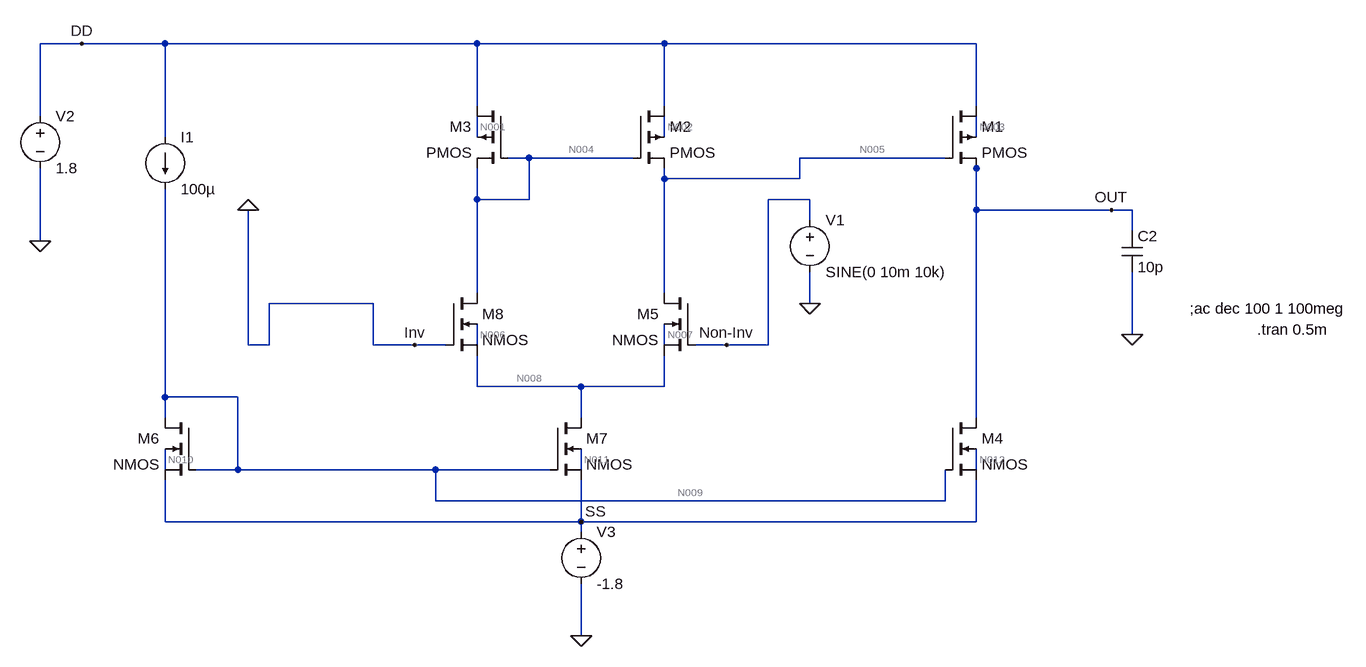
[diagram p0: schematic opamp_comparator.asc]
opamp_comparator.asc, the LTspice schematic file:
Version 4
SHEET 1 1048 884
WIRE -912 -144 -976 -144
WIRE -784 -144 -912 -144
WIRE -304 -144 -784 -144
WIRE -16 -144 -304 -144
WIRE 464 -144 -16 -144
WIRE -304 -48 -304 -144
WIRE -16 -48 -16 -144
WIRE 464 -48 464 -144
WIRE -976 -32 -976 -144
WIRE -784 0 -784 -144
WIRE -304 0 -304 -32
WIRE -16 0 -16 -32
WIRE 464 0 464 -32
WIRE -224 32 -256 32
WIRE -64 32 -224 32
WIRE 416 32 192 32
WIRE 464 48 464 32
WIRE -16 64 -16 48
WIRE 192 64 192 32
WIRE 192 64 -16 64
WIRE -304 96 -304 48
WIRE -224 96 -224 32
WIRE -224 96 -304 96
WIRE 208 96 144 96
WIRE 464 112 464 48
WIRE 672 112 464 112
WIRE 704 112 672 112
WIRE 208 128 208 96
WIRE 704 144 704 112
WIRE -976 160 -976 48
WIRE -304 240 -304 96
WIRE -16 240 -16 64
WIRE -464 256 -624 256
WIRE 208 256 208 208
WIRE 704 304 704 208
WIRE -656 320 -656 112
WIRE -624 320 -624 256
WIRE -624 320 -656 320
WIRE -464 320 -464 256
WIRE -400 320 -464 320
WIRE -352 320 -400 320
WIRE -304 320 -304 288
WIRE -16 320 -16 288
WIRE 80 320 32 320
WIRE 144 320 144 96
WIRE 144 320 80 320
WIRE -304 384 -304 336
WIRE -144 384 -304 384
WIRE -16 384 -16 336
WIRE -16 384 -144 384
WIRE -784 400 -784 80
WIRE -672 400 -784 400
WIRE -784 432 -784 400
WIRE -144 432 -144 384
WIRE 464 432 464 112
WIRE -784 512 -784 480
WIRE -672 512 -672 400
WIRE -672 512 -736 512
WIRE -368 512 -672 512
WIRE -192 512 -368 512
WIRE -144 512 -144 480
WIRE 464 512 464 480
WIRE -368 560 -368 512
WIRE 416 560 416 512
WIRE 416 560 -368 560
WIRE -784 592 -784 528
WIRE -144 592 -144 528
WIRE -144 592 -784 592
WIRE 464 592 464 528
WIRE 464 592 -144 592
WIRE -144 608 -144 592
WIRE -144 768 -144 688
FLAG 704 304 0
FLAG -656 112 0
FLAG -976 160 0
FLAG -144 768 0
FLAG 672 112 OUT
FLAG -144 592 SS
FLAG 80 320 Non-Inv
FLAG -400 320 Inv
FLAG -912 -144 DD
FLAG 208 256 0
SYMBOL pmos4 416 -48 R0
SYMATTR InstName M1
SYMATTR Value2 l=180n w=4u
SYMBOL pmos4 -64 -48 R0
SYMATTR InstName M2
SYMATTR Value2 l=180n w=2u
SYMBOL pmos4 -256 -48 M0
SYMATTR InstName M3
SYMATTR Value2 l=180n w=2u
SYMBOL nmos4 416 432 R0
SYMATTR InstName M4
SYMATTR Value2 l=180n w=4u
SYMBOL nmos4 32 240 M0
SYMATTR InstName M5
SYMATTR Value2 l=180n w=2u
SYMBOL nmos4 -736 432 M0
SYMATTR InstName M6
SYMATTR Value2 l=180n w=4u
SYMBOL nmos4 -192 432 R0
SYMATTR InstName M7
SYMATTR Value2 l=180n w=4u
SYMBOL nmos4 -352 240 R0
SYMATTR InstName M8
SYMATTR Value2 l=180n w=2u
SYMBOL cap 688 144 R0
SYMATTR InstName C2
SYMATTR Value 10p
SYMBOL voltage -976 -48 R0
WINDOW 123 0 0 Left 0
WINDOW 39 0 0 Left 0
SYMATTR InstName V2
SYMATTR Value 1.8
SYMBOL voltage -144 592 R0
WINDOW 123 0 0 Left 0
WINDOW 39 0 0 Left 0
SYMATTR InstName V3
SYMATTR Value -1.8
SYMBOL current -784 0 R0
WINDOW 123 0 0 Left 0
WINDOW 39 0 0 Left 0
SYMATTR InstName I1
SYMATTR Value 100µ
SYMBOL voltage 208 112 R0
WINDOW 123 0 0 Left 0
WINDOW 39 0 0 Left 0
SYMATTR InstName V1
SYMATTR Value SINE(0 10m 10k)
TEXT 896 296 Left 2 !.tran 0.5m
TEXT 792 264 Left 2 !;ac dec 100 1 100meg

The netlist it stands for:
* opamp_comparator.asc
M1 DD N005 OUT N003 PMOS l=180n w=4u
M2 DD N004 N005 N002 PMOS l=180n w=2u
M3 DD N004 N004 N001 PMOS l=180n w=2u
M4 OUT N009 SS N012 NMOS l=180n w=4u
M5 N005 Non-Inv N008 N007 NMOS l=180n w=2u
M6 N009 N009 SS N010 NMOS l=180n w=4u
M7 N008 N009 SS N011 NMOS l=180n w=4u
M8 N004 0 N008 N006 NMOS l=180n w=2u
C2 OUT 0 10p
V2 DD 0 1.8
V3 SS 0 -1.8
I1 DD N009 100µ
V1 Non-Inv 0 SINE(0 10m 10k)
.model NMOS NMOS
.model PMOS PMOS
.lib standard.mos
.tran 0.5m
;ac dec 100 1 100meg
.backanno
.end

* Results of the author's LTspice run, read from the files saved beside the schematic
* Operating Point, zero values left out:
*   V(dd) = 1.8 V
*   V(n005) = 1.129 V
*   V(out) = -1.13 V
*   V(n003) = 1.643 V
*   V(n004) = 1.129 V
*   V(n002) = 1.662 V
*   V(n001) = 1.662 V
*   V(n009) = -1.129 V
*   V(ss) = -1.8 V
*   V(n012) = -1.662 V
*   V(n008) = -670.8 mV
*   V(n007) = -532.8 mV
*   V(n010) = -1.662 V
*   V(n011) = -1.657 V
*   V(n006) = -532.8 mV
*   Id(M8) = 50 µA
*   Is(M8) = -50 µA
*   Id(M7) = 100 µA
*   Ib(M7) = 1.657 pA
*   Is(M7) = -100 µA
*   Id(M6) = 100 µA
*   Ib(M6) = 1.662 pA
*   Is(M6) = -100 µA
*   Id(M5) = 50 µA
*   Is(M5) = -50 µA
*   Id(M4) = 100 µA
*   Ib(M4) = 1.662 pA
*   Is(M4) = -100 µA
*   Id(M3) = 50 µA
*   Ib(M3) = -1.662 pA
*   Is(M3) = -50 µA
*   Id(M2) = 50 µA
*   Ib(M2) = -1.662 pA
*   Is(M2) = -50 µA
*   Id(M1) = 100 µA
*   Ib(M1) = -1.643 pA
*   Is(M1) = -100 µA
*   I(I1) = 100 µA
*   I(V3) = 300 µA
*   I(V2) = -300 µA
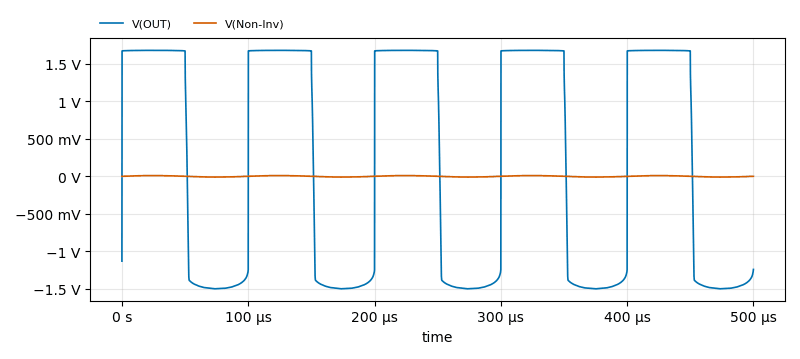
[diagram p1: Transient Analysis of opamp_comparator.asc, plotted from the saved traces]
* Transient Analysis, 1 run:
*   V(OUT): min -1.499 V, max 1.678 V, average 156.9 mV, rms 1.558 V, last -1.24 V
*   V(Non-Inv): min -9.992 mV, max 9.76 mV, average -4.845 µV, rms 6.975 mV, last 0 V